# EasyEDA Pro project EasyEDApro.epro, board Power board
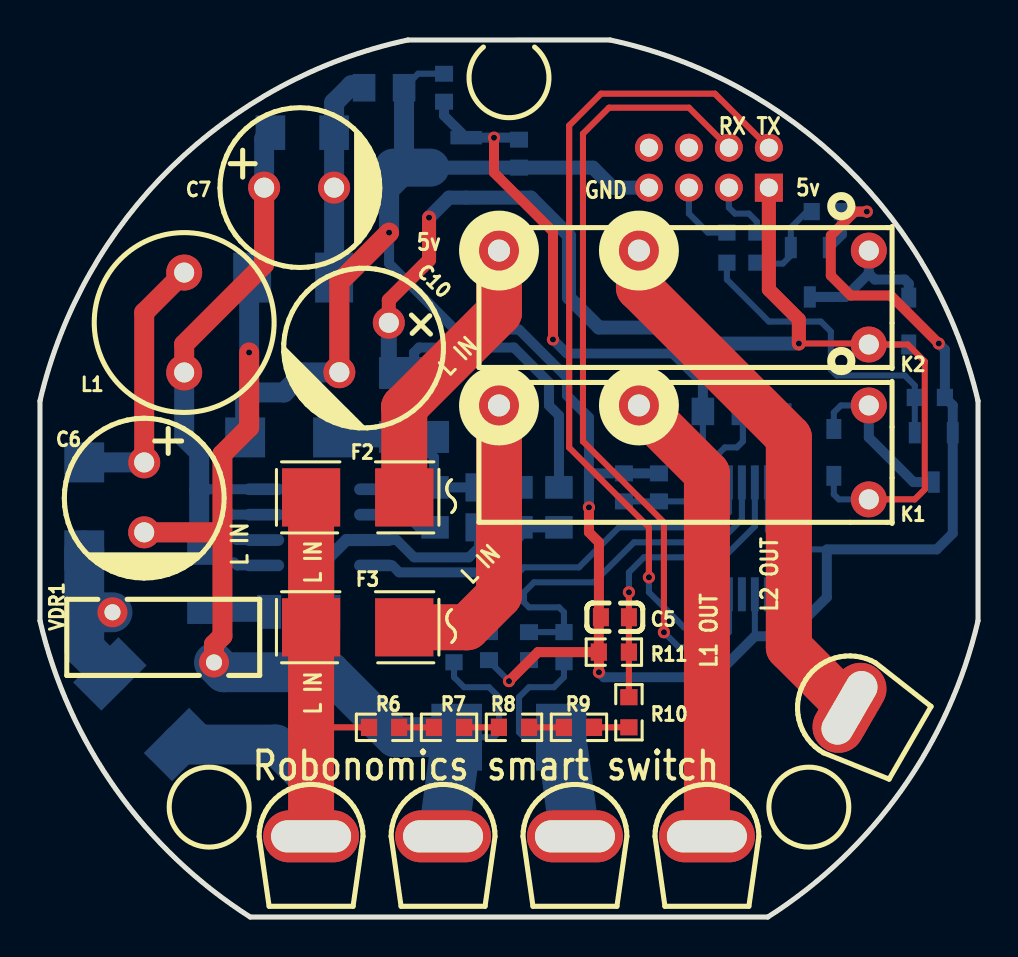
[diagram p4: board, top side]
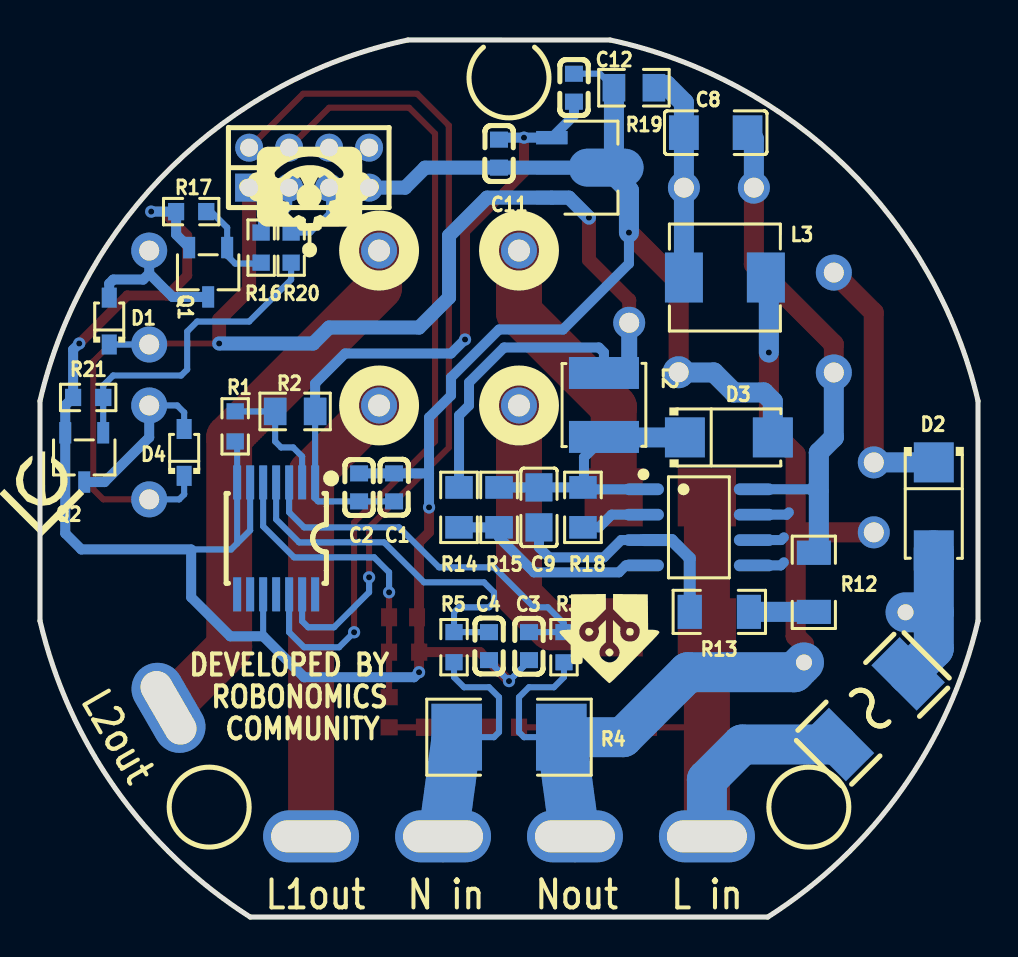
[diagram p5: board, bottom side, seen from below]

Outline 46.93 x 43.89 mm; copper layers: Top Layer, Bottom Layer. Coordinates in mm from the lower left corner of the outline.
Outline path: 0,25.83 0,14.83 arc(3.81,6.38) 10.52,0 36.41,0 arc(43.12,6.38) 46.93,14.83 46.93,25.83 arc(40.34,37.53) 28.52,43.89 18.41,43.89 arc(6.58,37.53) 0,25.83
Stack: Top Layer 0.035mm / Dielectric1 1.51mm FR4 er 4.5 / Bottom Layer 0.035mm

## Design rules (mm)
spacing safeClearance (default): track to track 0.152, other pairs 0.152 to 0.3
track width trackWidth (default): min 0.305, default 0.305, max 2.54
differential pair differentialPair (default): width min 0.305, default 0.305, max 2.54; gap min 0.305, default 0.305
via viaSize (default): diameter min 0.5, default 0.61, max 10; hole min 0.3, default 0.305, max 6

## Placement (name value [footprint] x y rotation side)
C1  10uF  [C0603]  29.21 21.5 270 bottom
C2  100nF  [C0603]  30.96 21.5 90 bottom
C3  68nF  [C0603]  22.46 13.56 90 bottom
C4  68nF  [C0603]  24.46 13.56 270 bottom
C5  68nF  [C0603]  28.76 15 0 top
C6  3.3uF  [CAP-TH_BD8.0-P3.50-D0.6-FD]  5.21 21 270 top
C7  3.3uF  [CAP-TH_BD8.0-P3.50-D0.6-FD]  12.96 36.5 0 top
C8  10nF  [C1206]  13.12 39.25 180 bottom
C9  2.2uF  [C0805]  21.96 20.5 270 bottom
C10  680uF  [CAP-TH_BD8.0-P3.50-D0.6-FD]  16.21 28.5 225 top
C11  10uF  [C0603]  23.96 38.2 270 bottom
C12  100nF  [C0603]  20.21 41.5 270 bottom
D1  -  [SOD-323_L1.8-W1.3-LS2.5-RD]  43.46 29.82 90 bottom
D2  -  [SMA_L4.3-W2.6-LS5.2-RD]  2.21 20.55 270 bottom
D3  -  [SMA_L4.3-W2.6-LS5.2-RD]  12.46 24 180 bottom
D4  -  [SOD-323_L1.8-W1.3-LS2.5-RD]  39.71 23.25 90 bottom
F2  -  [FUSE-SMD_L6.1-W2.6]  15.89 21 180 top
F3  -  [FUSE-SMD_L6.1-W2.6]  15.89 14.5 180 top
F4  JFC2410-1200FS  [F2410]  5.26 10.4 315 bottom
H1  -  [HDR-TH_8P-P2.00-V-M-R2-C4-S2.00]  33.46 37.5 180 bottom
K1  -  [RELAYS-TH_HF46F-G-XX-HS1-XXX]  32.21 23.25 180 top
K2  -  [RELAYS-TH_HF46F-G-XX-HS1-XXX]  32.21 31 180 top
L1  680uH  [IND-TH_BD9.0-P5.00-D0.7]  7.21 29.75 270 top
L2  470uH  [IND-SMD_L4.0-W4.0]  18.71 25.62 90 bottom
L3  10uH  [IND-SMD_L5.4-W5.2]  12.66 32 180 bottom
Q1  -  [SOT-23-3_L2.9-W1.6-P1.90-LS2.8-BR]  38.51 32.27 90 bottom
Q2  -  [SOT-23-3_L2.9-W1.6-P1.90-LS2.8-BR]  44.71 23 90 bottom
R1  10kΩ  [R0603]  37.16 24.55 270 bottom
R2  -  [R0805]  34.16 25.3 180 bottom
R3  510Ω  [R0603]  20.71 13.5 90 bottom
R4  0.001Ω  [RES-SMD_L6.3-W3.1-1]  23.46 9 180 bottom
R5  510Ω  [R0603]  26.21 13.5 90 bottom
R6  390kΩ  [R0603]  17.21 9.49 0 top
R7  390kΩ  [R0603]  20.46 9.49 0 top
R8  390kΩ  [R0603]  23.71 9.49 0 top
R9  390kΩ  [R0603]  26.96 9.49 0 top
R10  390kΩ  [R0603]  29.46 10.25 90 top
R11  510Ω  [R0603]  28.71 13.26 180 top
R12  1.5MΩ  [R1206]  8.21 16.75 270 bottom
R13  1.5MΩ  [R1206]  12.94 15.27 0 bottom
R14  36kΩ  [R0805]  25.96 20.5 270 bottom
R15  10kΩ  [R0805]  23.96 20.5 270 bottom
R16  1kΩ  [R0603]  35.86 33.5 270 bottom
R17  10kΩ  [R0603]  39.36 35.3 0 bottom
R18  820mΩ  [R0805]  19.76 20.5 270 bottom
R19  0Ω  [R0805]  17.21 41.5 180 bottom
R20  1kΩ  [R0603]  34.36 33.5 270 bottom
R21  10kΩ  [R0603]  44.52 26 0 bottom
U1  -  [TSSOP-14_L5.0-W4.4-P0.65-LS6.4-BL]  35.11 18.95 0 bottom
U2  -  [SOIC-8_L4.9-W3.9-P1.27-LS6.0-BL]  13.96 19.5 270 bottom
U3  -  [SOT-89-3_L4.5-W2.5-P1.50-LS4.2-BR]  19.96 37.5 0 bottom
U4  -  [screw_china_vadim]  13.56 3.04 0 top
U5  -  [screw_china_vadim]  20.16 3.04 0 top
U6  -  [screw_china_vadim]  26.76 3.04 0 top
U7  -  [screw_china_vadim]  41.36 9.97 60 top
U8  -  [screw_china_vadim]  33.37 3.04 0 top
VDR1  RM07D471KC14E100  [RES-TH_L9.5-W3.8-P5.08-D0.6-S2.5]  6.17 14 180 top

## Footprints (pads in the part's own frame, mm; a bottom-side part is the same pattern mirrored in y, then rotated)
C0603
  rect 0.8x0.9 smd: 1(-0.7,0) 2(0.7,0)
C0805
  rect 1.41x1.35 smd: 1(-1,0) 2(1,0)
C1206
  rect 1.485x1.728 smd: 1(-1.593,0) 2(1.593,0)
CAP-TH_BD8.0-P3.50-D0.6-FD
  round 1.6 hole 1: 1(-1.75,0) 2(1.75,0)
F2410
  rect 2x3.2 smd: 1(-2.5,0) 2(2.5,0)
FUSE-SMD_L6.1-W2.6
  rect 2.91x2.91 smd: 1(-2.33,0) 2(2.33,0)
HDR-TH_8P-P2.00-V-M-R2-C4-S2.00
  rect 1.4x1.4 hole 0.9: 1(-3,-1)
  round 1.4 hole 0.9: 2(-3,1) 3(-1,-1) 4(-1,1) 5(1,-1) 6(1,1) 7(3,-1) 8(3,1)
IND-SMD_L4.0-W4.0
  rect 1.6x3.5 smd: 1(-1.6,0) 2(1.6,0)
IND-SMD_L5.4-W5.2
  rect 1.9x2.5 smd: 1(2.05,0) 2(-2.05,0)
IND-TH_BD9.0-P5.00-D0.7
  round 1.8 hole 1: 1(-2.5,0) 2(2.5,0)
R0603
  rect 0.806x0.864 smd: 1(-0.753,0) 2(0.753,0)
R0805
  rect 1.133x1.377 smd: 1(-1,0) 2(1,0)
R1206
  rect 1.208x1.701 smd: 1(-1.479,0) 2(1.479,0)
RELAYS-TH_HF46F-G-XX-HS1-XXX
  round 1.8 hole 1: 1(-9.25,-2.35) 6(-9.25,2.35)
  round 1.8 hole 1.1: 2(2.25,-2.35) 3(9.25,-2.35)
RES-SMD_L6.3-W3.1-1
  rect 2.535x3.348 smd: 1(-2.618,0) 2(2.618,0)
RES-TH_L9.5-W3.8-P5.08-D0.6-S2.5
  round 1.5 hole 0.8: 1(-2.54,1.255) 2(2.54,-1.255)
screw_china_vadim
  oval 4.8x2.6 hole 4x1.6: 1(0,1)
SMA_L4.3-W2.6-LS5.2-RD
  rect 2x2 smd: 1(-2.2,0) 2(2.2,0)
SOD-323_L1.8-W1.3-LS2.5-RD
  rect 1x0.75 smd: 1(-1.173,0) 2(1.173,0)
SOIC-8_L4.9-W3.9-P1.27-LS6.0-BL
  oval 0.588x2.045 smd: 1(-1.905,-2.772) 2(-0.635,-2.772) 3(0.635,-2.772) 4(1.905,-2.772) 5(1.905,2.772) 6(0.635,2.772) 7(-0.635,2.772) 8(-1.905,2.772)
SOT-23-3_L2.9-W1.6-P1.90-LS2.8-BR
  rect 1.07x0.6 smd: 1(1.235,-0.95) 2(1.235,0.95) 3(-1.235,0)
SOT-89-3_L4.5-W2.5-P1.50-LS4.2-BR
  rect 1.575x0.672 smd: 1(1.356,-1.5) 3(1.356,1.5)
  custom 5.377x1.9 smd: 2(-1.356,0)
TSSOP-14_L5.0-W4.4-P0.65-LS6.4-BL
  rect 0.4x1.7 smd: 1(-1.95,-2.8) 2(-1.3,-2.8) 3(-0.65,-2.8) 4(0,-2.8) 5(0.65,-2.8) 6(1.3,-2.8) 7(1.95,-2.8) 8(1.95,2.8) 9(1.3,2.8) 10(0.65,2.8) 11(0,2.8) 12(-0.65,2.8) 13(-1.3,2.8) 14(-1.95,2.8)

## Nets
As in the schematic.

Pads without a net: H1 6; U1 11 14

## Via types
v1: diameter 0.61, hole 0.305, Top Layer to Bottom Layer, 14 vias

## Routing (per net, layer and track width the routed paths; a pad name or vN(x,y) marks a point on that pad's centre or on a via; arc(x,y) is an arc through that point)
+5V: length 76.6
  Top Layer w0.305: K1.6 43.76,20.9 44.26,21.4 44.26,27.8 43.41,28.65 K2.6 41.41,28.7 v1(37.96,28.7)
  Top Layer w0.7: C10.1 17.45,30.87 19.46,32.88 v1(19.46,35) ; v1(37.96,28.7) 37.96,29.9 36.46,31.4 H1.1
  Bottom Layer w0.305: K1.6 39.96,20.9 39.71,21.15 D4.1 ; D1.1 K2.6
  Bottom Layer w0.5: 18.71,27.25 18.71,28.25 18.96,28.5 23.71,28.5 25.46,26.75 25.46,25.6 25.96,25.1 R14.1
  Bottom Layer w0.7: v1(19.46,35) 20.46,36 U3.3 24.56,36 26.46,34.1 26.46,31 27.96,29.5 32.46,29.5 33.26,28.7 v1(37.96,28.7)
  Bottom Layer w0.8: C10.1 17.45,27.76 17.96,27.25 18.71,27.25
GND: length 136.8
  Top Layer w0.305: 27.96,14.9 C5.1
  Top Layer w0.5: v1(44.96,28.7) 42.56,31.1 40.56,31.1 39.56,32.1 39.56,34.1 40.76,35.3 v1(41.36,35.3) ; v1(27.46,20.5) 27.46,19.25 27.96,18.75 27.96,14.9 27.96,14.89 27.96,13.26 ; 27.96,13.26 27.96,13.25 v1(27.96,12.25) ; 27.96,13.26 24.91,13.26 v1(23.46,11.81)
  Top Layer w1: C10.2 14.98,31.76 v1(17.46,34.25)
  Bottom Layer w0.305: 37.06,18.7 37.37,18.4 39.37,18.4 39.36,18.39 ; 37.06,18.7 36.41,19.35 U1.6 ; 37.06,18.7 U1.7 37.06,23.7 R1.2 ; C4.2 24.46,12.81 v1(23.46,11.81) 22.46,12.81 C3.1 ; C12.1 18.91,42.2 R19.1 ; U1.10 35.76,14.05
  Bottom Layer w0.5: C2.2 C1.1 27.46,22.2 ; 39.36,18.39 39.36,16 37.41,14.05 35.76,14.05 ; v1(44.96,28.7) 45.27,28.39 R21.2 45.66,25.61 Q2.2 45.66,19.2 44.86,18.4 39.37,18.4 ; v1(17.46,34.25) 17.46,32.7 20.76,29.4 23.96,29.4 26.36,27 26.36,26.1 27.46,25 27.46,22.2 ; 27.46,22.2 v1(27.46,20.5) ; v1(41.36,35.3) R17.2 40.12,34.15 Q1.2 ; v1(27.96,12.25) 28.21,12 33.71,12 35.71,14
  Bottom Layer w0.7: H1.7 28.66,36.5 27.66,37.5 C11.2 U3.2
  Bottom Layer w1: D3.2 10.26,25.8 10.71,26.25 12.21,26.25 13.21,27.25 14.96,27.25 C10.2 ; R19.1 18.21,37.89 U3.2 17.46,36.36 v1(17.46,34.25)
GNDS: length 14.2
  Bottom Layer w0.5: 19.71,21.5 19.62,21.41 U2.1 ; 19.71,21.5 19.71,23 18.71,24 ; 19.71,21.5 C9.1 R15.1
  Bottom Layer w1: 18.71,24 D3.1
VDD3V3: length 34.4
  Top Layer w0.5: v1(22.71,39) 22.71,37.25 25.66,34.3 v1(25.66,28.9)
  Bottom Layer w0.305: C1.2 C2.1 33.01,20.8 33.16,20.95 U1.1 R2.2
  Bottom Layer w0.5: C11.1 23.86,39 v1(22.71,39) U3.1 20.21,40.11 C12.2 ; v1(25.66,28.9) 26.36,28.2 31.66,28.2 33.16,26.7 R2.2
GPIO_RELAY1: length 3.6
  Bottom Layer w0.305: H1.5 32.46,35.2 33.41,34.25 R20.1
GPIO_RELAY2: length 3.2
  Bottom Layer w0.305: R16.1 35.86,34.8 35.46,35.2 34.76,35.2 34.46,35.5 H1.3
L_IN: length 30
  Top Layer w0.305: 13.56,9.43 13.62,9.49 R6.1
  Top Layer w2.3: 13.56,4 F3.2 F2.2
  Bottom Layer w2: U4.1 13.56,6.87 11.8,8.63 F4.2
L_OUT1: length 23
  Top Layer w2.3: 33.36,4 33.36,22.2 K1.2
L_OUT2: length 27.2
  Top Layer w2.3: 40.46,10.5 37.46,13.5 37.46,24 29.96,31.5 K2.2
N_IN: length 12.4
  Bottom Layer w0.305: R5.1 26.21,12 25.71,11.5 24.46,11.5 23.96,11 23.96,9.25 24.21,9 R4.1
  Bottom Layer w2.5: 26.76,4 R4.1
N_OUT: length 50.1
  Top Layer w1: v1(10.46,28.25) 10.46,24.5 9.13,23.16 9.13,14.06 8.71,13.64 VDR1.1 ; C6.2 9.09,19.25
  Bottom Layer w0.305: R4.2 22.71,9 22.96,9.25 22.96,11 22.46,11.5 21.21,11.5 20.71,12 R3.1
  Bottom Layer w1: L3.1 10.46,31.85 v1(10.46,28.25)
  Bottom Layer w2: VDR1.1 9.2,12.25 14.51,12.25 17.76,9 R4.2
  Bottom Layer w2.5: 20.16,4 R4.2
PM_RX: length 41.1
  Top Layer w0.305: v1(31.21,14.25) 31.21,19.75 27.16,23.8 27.16,39.2 28.46,40.5 32.46,40.5 H1.4
  Bottom Layer w0.305: v1(31.21,14.25) 31.96,13.5 33.71,13.5 34.46,14.25 U1.12
PM_TX: length 42.3
  Top Layer w0.305: v1(30.46,17) 30.46,19.5 26.47,23.49 26.47,39.61 28.06,41.2 33.76,41.2 H1.2
  Bottom Layer w0.305: v1(30.46,17) 30.46,16.25 32.21,14.5 33.51,14.5 33.81,14.81 U1.13
$1N1298: length 1.7
  Top Layer w0.305: R6.2 R7.1
$1N1299: length 1.7
  Top Layer w0.305: R7.2 R8.1
$1N1300: length 1.7
  Top Layer w0.305: R8.2 26.21,9.49
$1N1301: length 1.7
  Top Layer w0.305: R9.2 29.46,9.49
$1N1304: length 19.7
  Bottom Layer w0.305: C4.1 R5.2 26.21,15.25 25.96,15.5 24.46,15.5 24.21,15.75 24.21,16.25 24.71,16.75 27.71,16.75 29.71,18.75 33.96,18.75 35.11,19.9 U1.4
$1N1308: length 19.7
  Bottom Layer w0.305: U1.3 34.46,20.25 33.71,19.5 28.96,19.5 26.96,17.5 24.21,17.5 22.21,15.5 21.53,15.5 20.71,14.69 R3.2 C3.2
$1N1312: length 6.5
  Bottom Layer w0.305: 37.16,25.31 37.16,25.3 R2.1 35.16,23.8 34.86,23.5 34.26,23.5 33.81,23.05 U1.2
$1N1323: length 15.7
  Top Layer w0.305: R10.2 R11.1 C5.2 v1(29.46,16.25)
  Bottom Layer w0.305: U1.5 35.76,19.55 34.21,18 30.21,18 29.46,17.25 v1(29.46,16.25)
$1N34042: length 15.9
  Bottom Layer w0.305: Q2.1 R21.1 43.76,26.6 43.26,27.1 39.86,27.1 39.56,27.4 39.56,29.3 39.06,29.8 36.46,29.8 34.36,31.9 R20.2
$1N34045: length 8.5
  Bottom Layer w0.305: K1.1 40.06,25.6 39.71,25.25 D4.2
  Bottom Layer w0.5: Q2.3 43.7,21.77 41.46,24 K1.1
$1N34663: length 4.7
  Bottom Layer w0.305: R16.2 35.91,32.7 37.16,32.7 37.56,33.1 Q1.1 37.56,34.5 38.36,35.3 R17.1
$1N34666: length 7.5
  Bottom Layer w0.5: Q1.3 40.29,31.03 41.46,32.2 ; 41.46,32.2 K2.1 ; 41.46,32.2 41.76,31.9 43.26,31.9 43.46,31.7 D1.2
$1N45269: length 13.3
  Top Layer w1: L1.1 5.21,30.25 C6.1
  Bottom Layer w1: C6.1 D2.1
$1N45602: length 31.3
  Top Layer w1: L1.2 7.21,28.66 11.21,32.66 C7.1
  Bottom Layer w0.5: 9.46,20.25 9.58,20.14 U2.7 ; 7.96,21.5 8.06,21.41 U2.8 ; 9.71,19 9.85,18.86 U2.6 ; 9.71,17.75 9.87,17.59 U2.5
  Bottom Layer w1: 8.06,21.41 7.96,21.31 7.96,18.48 R12.1 ; 7.96,21.5 7.96,23.25 7.21,24 L1.2 ; C7.1 11.21,38.94 C8.2
$1N45640: length 10.7
  Bottom Layer w1: L3.2 C7.2 C8.1 14.71,40.75 15.59,41.62 16.09,41.62 R19.2
$1N46486: length 3.2
  Bottom Layer w1: R13.1 R12.2
$1N46932: length 3.2
  Bottom Layer w0.5: U2.2 18.33,20.14 18.96,19.5 19.71,19.5
$1N47536: length 10.6
  Bottom Layer w0.5: R14.2 R15.2 23.96,19 22.21,17.25 17.96,17.25 17.62,17.59 U2.4
$1N48801: length 12.2
  Bottom Layer w0.5: U2.3 17.85,18.86 18.71,18 21.46,18 21.96,18.5 C9.2
  Bottom Layer w0.6: U2.3 15.33,18.86 14.42,17.96 R13.2
$1N58982: length 14.9
  Top Layer w2.3: F3.1 21.36,14.5 22.96,16.1 K1.3
$1N59380: length 14.3
  Top Layer w2.3: K2.3 22.96,30.25 18.21,25.5 18.22,25.49 F2.1
$1N91130: length 8.1
  Bottom Layer w2: F4.1 2.21,13.45 2.21,15.25 ; D2.2 2.21,15.25 ; 2.21,15.25 VDR1.2

## Copper pours and planes (outline as drawn; the poured copper is in the pictures)
$1N45602 on Bottom Layer: 8.21,21.25 9.79,21.25 9.95,21.41 10.45,21.41 10.45,17.73 10.21,17.5 8.94,17.5 8.21,18.23

## Text on the board
Bottom Silkscreen Layer: COMMUNITY | ROBONOMICS | DEVELOPED BY | L2out | L in | Nout | N in | L1out
Top Silkscreen Layer: 5v | GND | RX | TX | L IN | L1 OUT | L2 OUT | Robonomics smart switch
